# Altium schematic sheet PC_Power.SchDoc: Payload Computer - Power Supply
size A3; Engineer: Matt Brindley; Organization: BLUEsat Project; Address1: Room 419; Address2: School of EE&T; Address3: UNSW, NSW 2052; Address4: Australia
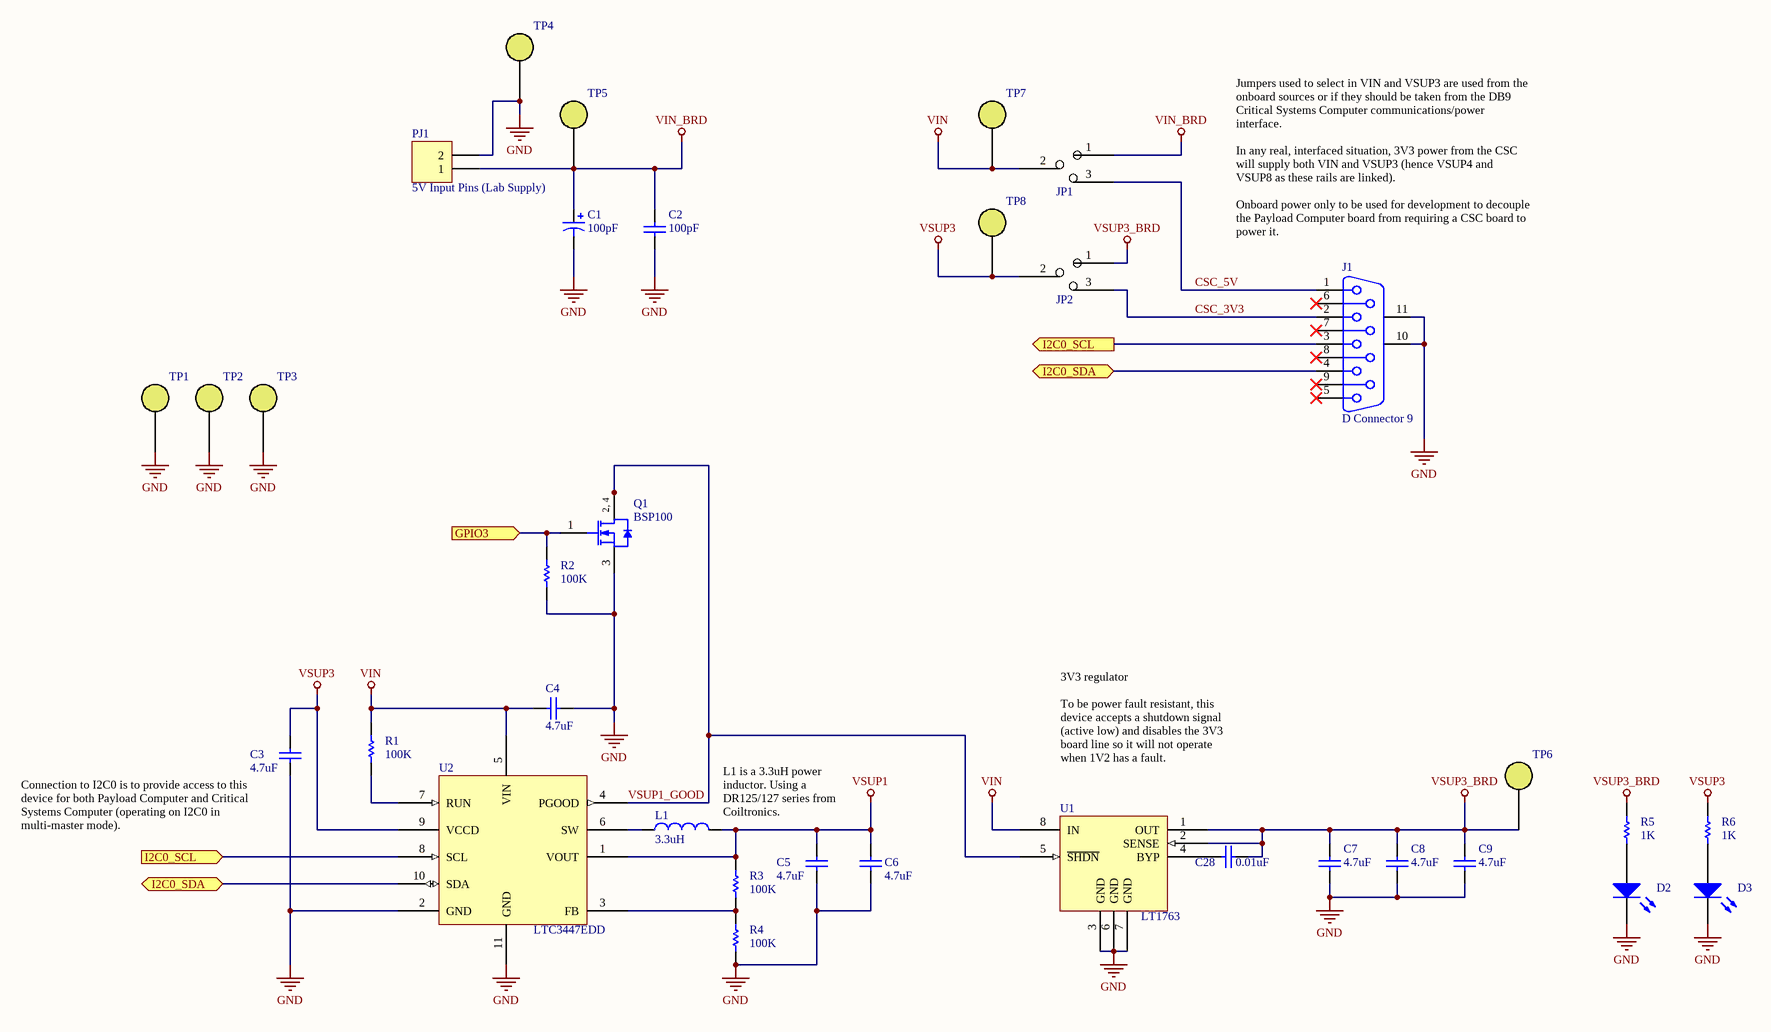
[diagram p0: PC_Power.SchDoc]

## Parts
C1  value 100pF  [C0805]  (hidden comment: Cap Pol3)
C2  value 100pF  [C0805]  (hidden comment: Cap Semi)
C3  value 4.7uF  [C0805]  (hidden comment: Cap Semi)
C4  value 4.7uF  [C0805]  (hidden comment: Cap Semi)
C5  value 4.7uF  [C0805]  (hidden comment: Cap Semi)
C6  value 4.7uF  [C0805]  (hidden comment: Cap Semi)
C7  value 4.7uF  [C0805]  (hidden comment: Cap Semi)
C8  value 4.7uF  [C0805]  (hidden comment: Cap Semi)
C9  value 4.7uF  [C0805]  (hidden comment: Cap Semi)
C28  value 0.01uF  [C0805]  (hidden comment: Cap Semi)
D2  LED2  [DSO-F2/D6.1]  (value not drawn)
D3  LED2  [DSO-F2/D6.1]  (value not drawn)
J1  D Connector 9  [DSUB1.385-2H9]
JP1  Jumper  [HDR1X3]  (value not drawn)
JP2  Jumper  [HDR1X3]  (value not drawn)
L1  value 3.3uH  [INDC13855X60N]  (hidden comment: Inductor)
PJ1  5V Input Pins (Lab Supply)  [HDR1X2]
Q1  BSP100  [SOT223_N]
R1  value 100K  [6-0805_L]  (hidden comment: Res Semi)
R2  value 100K  [6-0805_L]  (hidden comment: Res Semi)
R3  value 100K  [6-0805_L]  (hidden comment: Res Semi)
R4  value 100K  [6-0805_L]  (hidden comment: Res Semi)
R5  value 1K  [6-0805_L]  (hidden comment: Res Semi)
R6  value 1K  [6-0805_L]  (hidden comment: Res Semi)
TP1  Test Point  [PIN1]  (value not drawn)
TP2  Test Point  [PIN1]  (value not drawn)
TP3  Test Point  [PIN1]  (value not drawn)
TP4  Test Point  [PIN1]  (value not drawn)
TP5  Test Point  [PIN1]  (value not drawn)
TP6  Test Point  [PIN1]  (value not drawn)
TP7  Test Point  [PIN1]  (value not drawn)
TP8  Test Point  [PIN1]  (value not drawn)
U1  LT1763  [SOIC127P600X175-8N]
U2  LTC3447EDD  [LTC3447_DFP11]

## Ports
GPIO3 (in), I2C0_SCL (in), I2C0_SCL (out), I2C0_SDA (bidir)

## Nets
GND: C1.2 C2.1 C3.2 C4.1 C5.2 C6.2 C7.2 C8.2 C9.2 D2.2(K) D3.2(K) J1.10(MH1) J1.11(MH2) PJ1.2 Q1.3(S) R2.1 R4.1 TP1.1 TP2.1 TP3.1 TP4.1 U1.3(GND) U1.6(GND) U1.7(GND) U2.2(GND) U2.11(GND)
VIN: C4.2 JP1.2 R1.2 TP7.1 U1.8(IN) U2.5(VIN)
VIN_BRD: C1.1 C2.2 JP1.1 PJ1.1 TP5.1
VSUP1: C5.1 C6.1 L1.2 R3.2 U2.1(VOUT)
VSUP3: C3.1 JP2.2 R6.2 TP8.1 U2.9(VCCD)
VSUP3_BRD: C7.1 C8.1 C9.1 C28.2 JP2.1 R5.2 TP6.1 U1.1(OUT) U1.2(SENSE)
CSC_3V3: J1.2 JP2.3
CSC_5V: J1.1 JP1.3
GPIO3: Q1.1(G) R2.2 ; port GPIO3
I2C0_SCL: J1.3 U2.8(SCL) ; port I2C0_SCL
I2C0_SDA: J1.4 U2.10(SDA) ; port I2C0_SDA
VSUP1_GOOD: Q1.2(D) Q1.4(D) U1.5(~{SHDN}) U2.4(PGOOD)
NetC28_1: C28.1 U1.4(BYP)
NetD2_1: D2.1(A) R5.1
NetD3_1: D3.1(A) R6.1
NetL1_1: L1.1 U2.6(SW)
NetR1_1: R1.1 U2.7(RUN)
NetR3_1: R3.1 R4.2 U2.3(FB)

Not connected (* = marked no-connect by the designer): J1 5* 6* 7* 8* 9*

## Notes on the sheet
- (near J1) Jumpers used to select in VIN and VSUP3 are used from the onboard sources or if they should be taken from the DB9 Critical Systems Computer communications/power interface.
  In any real, interfaced situation, 3V3 power from the CSC will supply both VIN and VSUP3 (hence VSUP4 and VSUP8 as these rails are linked).
  Onboard power only to be used for development to decouple the Payload Computer board from requiring a CSC board to power it.
- (near C3) Connection to I2C0 is to provide access to this device for both Payload Computer and Critical Systems Computer (operating on I2C0 in multi-master mode).
- (near L1) L1 is a 3.3uH power inductor. Using a DR125/127 series from Coiltronics.
- (near U1) 3V3 regulator
  To be power fault resistant, this device accepts a shutdown signal (active low) and disables the 3V3 board line so it will not operate when 1V2 has a fault.
- Title
- Size:
- Date:
- A3
- Author:
- Time:
- Revision:
- Sheet
- of
- File:
- (in symbol BSP100) 2, 4

## Library data of the parts
C1 = Cap Pol3: Polarized Capacitor (Surface Mount); Published: 8-Jun-2000; LatestRevisionDate: 29-May-2009; LatestRevisionNote: IPC-7351 Footprint Added.; PackageReference: C0805; Publisher: Altium Limited; PackageDescription: Chip Capacitor
C2-C9 C28 = Cap Semi: Capacitor (Semiconductor SIM Model); Published: 8-Jun-2000; LatestRevisionDate: 29-May-2009; LatestRevisionNote: IPC-7351 Footprint Added.; PackageReference: C1206; Publisher: Altium Limited; PackageDescription: Chip Capacitor
D2 D3 = LED2: Typical RED, GREEN, YELLOW, AMBER GaAs LED; Published: 8-Jun-2000; LatestRevisionDate: 17-Jul-2002; LatestRevisionNote: Re-released for DXP Platform.; PackageVersion: Feb-2002; PackageReference: 3.2X1.6X1.1; Publisher: Altium Limited
J1 = D Connector 9: Receptacle Assembly, 9 Position, Right Angle; PackageDocument: O; Positions: 9; Published: 15-Jun-2001; LatestRevisionDate: 17-Jul-2002; LatestRevisionNote: Re-released for DXP Platform.; DatasheetDocument: 1-Sep-1999; PackageReference: 788750; Publisher: Altium Limited; Orientation: Right Angle; Gender: Receptacle
JP1 JP2 = 2 position jumper: 3 pin jumper for selection; Published: 8-Jun-2000; LatestRevisionDate: 08-Jul-2005; LatestRevisionNote: Mech Layer 1 removed.; PackageReference: LED-0; Publisher: Altium Limited
L1 = Inductor: Code_IEC: 1005; Published: 8-Jun-2000; LatestRevisionDate: 29-May-2009; LatestRevisionNote: IPC-7351 Footprint Added.; PackageReference: 0402-A; Publisher: Altium Limited; PackageDescription: Chip Inductor; Code_JEITA: 0402
PJ1 = Header 2: Header, 2-Pin; LatestRevisionDate: 17-Jul-2002; LatestRevisionNote: Re-released for DXP Platform.; Publisher: Altium Limited
Q1 = BSP100: N-channel Enhancement Mode MOSFET; Published: 17-Sep-2003; LatestRevisionDate: 12-Dec-2006; LatestRevisionNote: IPC-7351 Footprint Added.; DatasheetVersion: Feb-1999; PackageVersion: Aug-2001; PackageReference: SOT223; Publisher: Altium Limited; PackageDescription: 4-Pin SOT-223 Package 2.3 mm Pitch, 7 mm Lead Span; ComponentLink1Description: Manufacturer Link; ComponentLink1URL: http://www.semiconductors.philips.com/; ComponentLink2Description: Datasheet; ComponentLink2URL: http://www.semiconductors.philips.com/acrobat/datasheets/BSP100_3.pdf
R1-R6 = Res Semi: Semiconductor Resistor; Published: 8-Jun-2000; LatestRevisionDate: 17-Jul-2002; LatestRevisionNote: Re-released for DXP Platform.; PackageReference: AXIAL-0.5; Publisher: Altium Limited
U1 = LT1763: Linear Technology Voltage Regulator; Published: 8-Jun-2000; LatestRevisionDate: 08-Jul-2005; LatestRevisionNote: Mech Layer 1 removed.; PackageReference: LED-0; Publisher: Altium Limited
U2 = LTC3447EDD: I2C Controlled VReg; Published: 8-Jun-2000; LatestRevisionDate: 08-Jul-2005; LatestRevisionNote: Mech Layer 1 removed.; PackageReference: LED-0; Publisher: Altium Limited
TP1-TP8 = Test Point: Published: 8-Jun-2000; LatestRevisionDate: 08-Jul-2005; LatestRevisionNote: Mech Layer 1 removed.; PackageReference: LED-0; Publisher: Altium Limited